# Altium project Carrier_Board_Template.PrjPcb (part 1 of 2)
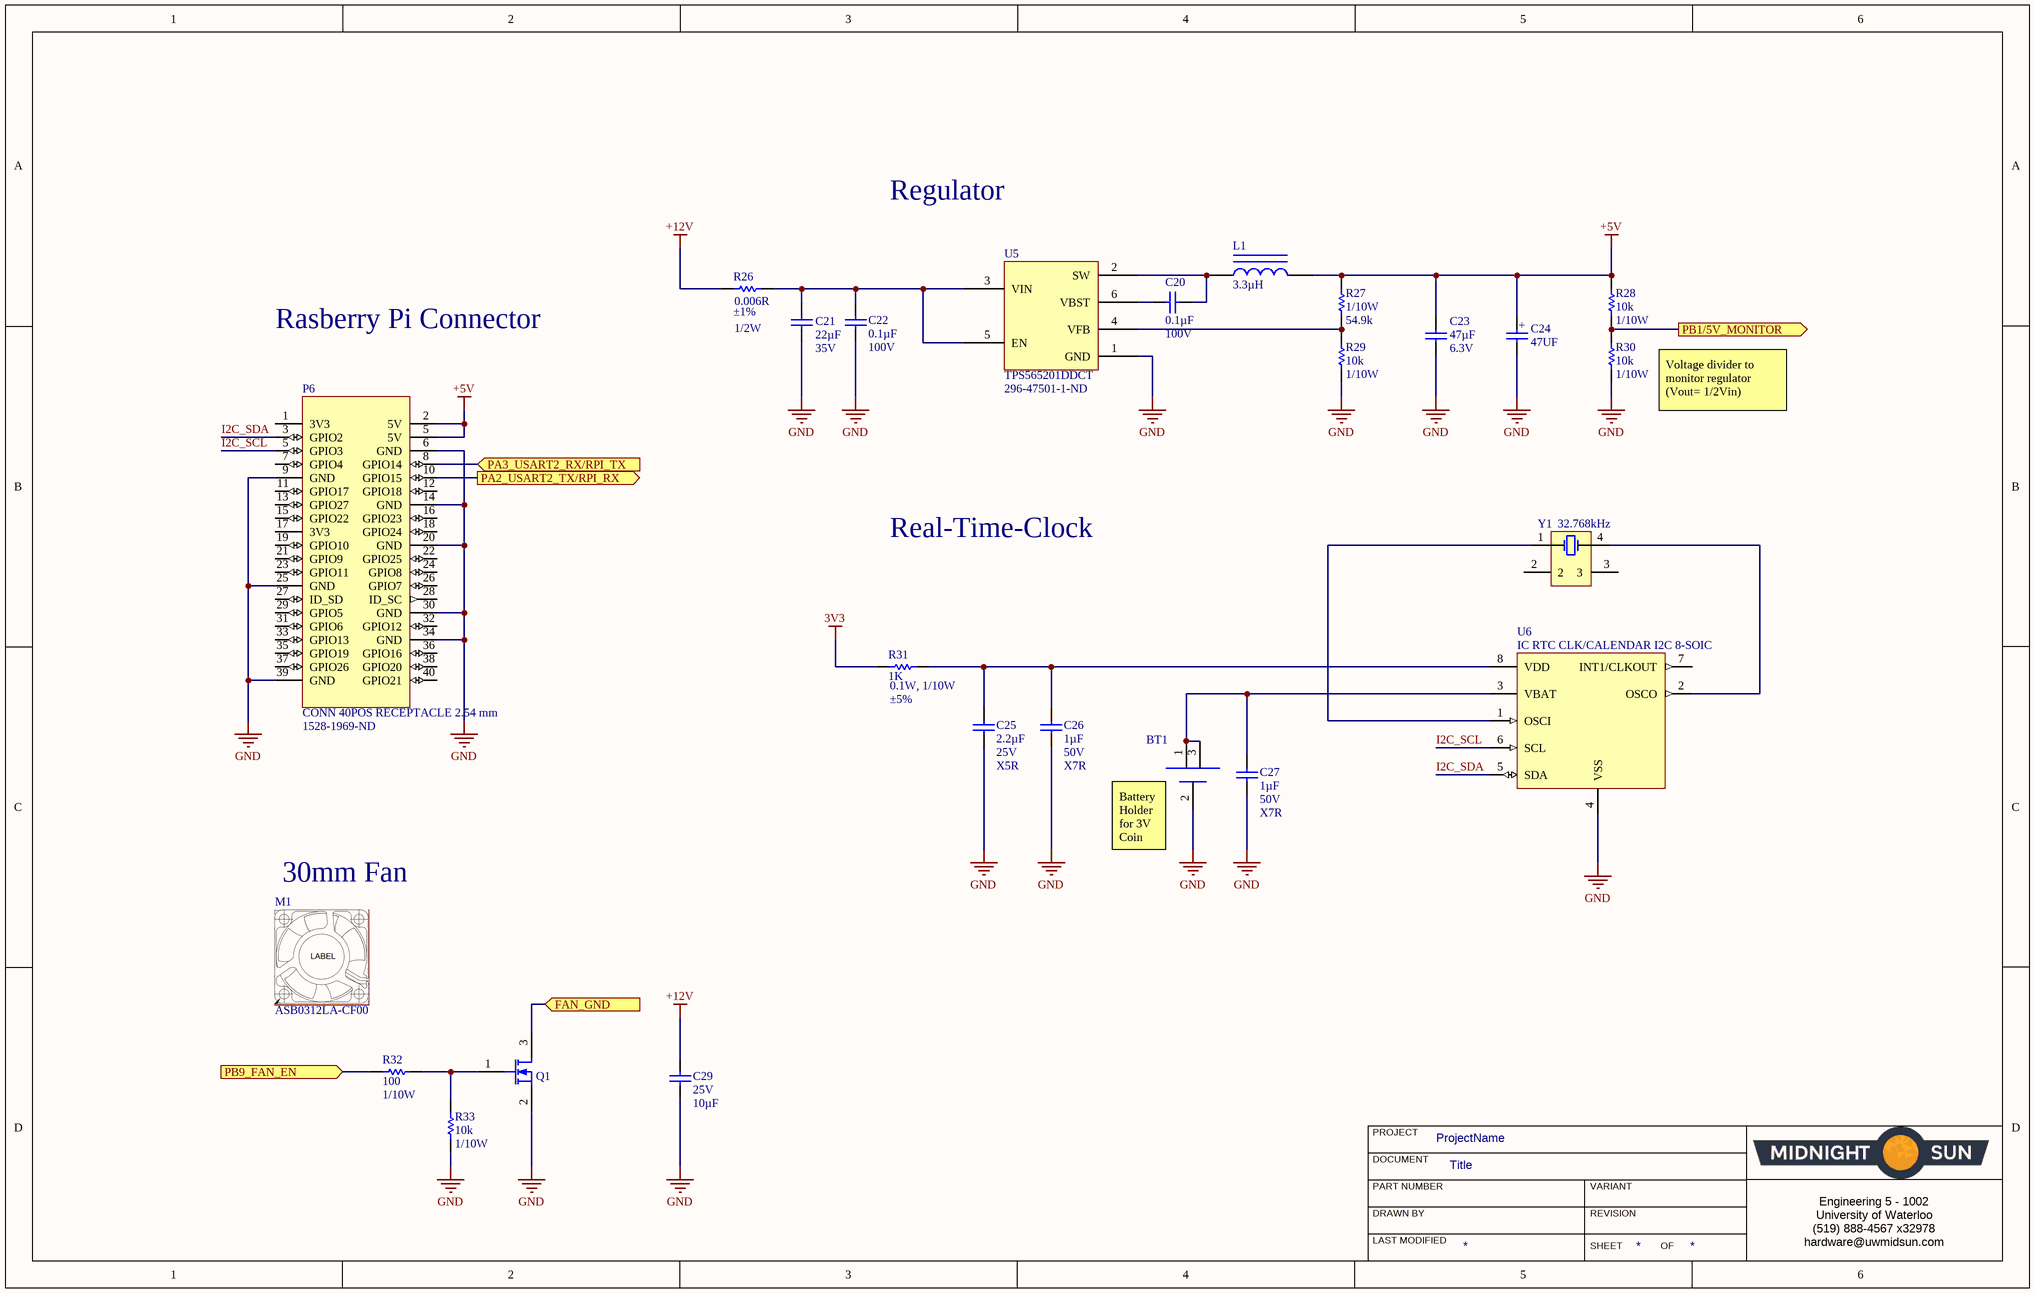
[diagram p0: rPi.SchDoc]

4 sheets, 86 parts. Net scope: flat (ports and power ports of the same name join across sheets).
Board file: Carrier_Board_Template.PcbDoc
Sheets:
  rPi.SchDoc
  buttons.SchDoc
  connectors.SchDoc
  leds.SchDoc

## Sheet rPi.SchDoc: Title
size B; Organization: Midnight Sun Solar Rayce Car Team; Address1: University of Waterloo; Address2: 200 University Ave W; Address3: Waterloo, ON, Canada; Address4: N2L 3E9; Website: www.uwmidsun.com; ProjectName: ProjectName

### Parts
BT1  HOLDER BATTERY COIN 12MM DIA  [HOLDER COIN CELL 1220 3V]  (value not drawn)
C20  Capacitance: 0.1µF  Voltage: 100V  [CAP, 0805]  (hidden comment: CAP CER 0.1UF 100V 10% X7R 0805)
C21  CAP CER 22UF 35V X5R 0805  [CAP, 0805]  (value not drawn)
C22  Capacitance: 0.1µF  Voltage: 100V  [CAP, 0805]  (hidden comment: CAP CER 0.1UF 100V 10% X7R 0805)
C23  CAP CER 47UF 6.3V X7R 1210  [1210]  (value not drawn)
C24  47UF  [CAP ALUM 6.3MM RADIAL SMD]
C25  Capacitance: 2.2µF  Voltage: 25V  Temperature Coefficient: X5R  [CAP, 0603]  (hidden comment: CAP CER 2.2UF 25V 10% X5R 0603)
C26  Capacitance: 1µF  Voltage: 50V  Temperature Coefficient: X7R  [CAP, 0603]  (hidden comment: CAP CER 1UF 50V 10% X7R 0603)
C27  Capacitance: 1µF  Voltage: 50V  Temperature Coefficient: X7R  [CAP, 0603]  (hidden comment: CAP CER 1UF 50V 10% X7R 0603)
C29  Voltage - Rated: 25V  Capacitance: 10µF  [CAP, 0805]  (hidden comment: CAP CER 10uF 25V 10% X5R 0805)
L1  Inductance: 3.3µH  [IND 3.3UH 5.2A 20 MOHM SMD VLP8040]  (hidden comment: IND 3.3uH 5.2A 20MOHM SMD)
M1  Manufacturer Part Number: ASB0312LA-CF00  [FAN AXIAL 30x10MM 12VDC]  (hidden comment: FAN AXIAL 30x10MM 12VDC)
P6  CONN 40POS RECEPTACLE 2.54 mm  Supplier Part Number 1: 1528-1969-ND  [CONN 40POS RECEPTACLE 2.54 MM]
Q1  MOSFET N-CH 30V 6.2A 0.9W SOT-23  [MOSFET N-CH 30V 6.2A 0.9W SOT-23]  (value not drawn)
R26  Tolerance: ±1%  Resistance (Ohms): 0.006R  Power (Watts): 1/2W  [RES 1206]  (hidden comment: RES 0.006 OHM 1% 1/2W 1206)
R27  Power (Watts): 1/10W  Resistance (Ohms): 54.9k  [RES, 0603]  (hidden comment: RES 54.9K OHM 1% 1/10W 0603)
R28  Resistance: 10k  Power: 1/10W  [RES, 0603]  (hidden comment: RES 10K OHM 1% 1/10W 0603)
R29  Resistance: 10k  Power: 1/10W  [RES, 0603]  (hidden comment: RES 10K OHM 1% 1/10W 0603)
R30  Resistance: 10k  Power: 1/10W  [RES, 0603]  (hidden comment: RES 10K OHM 1% 1/10W 0603)
R31  1K  Tolerance: ±5%  Power (Watts): 0.1W, 1/10W  [RES, 0603]
R32  Resistance: 100  Power: 1/10W  [RES, 0603]  (hidden comment: RES 100 OHM 1% 1/10W 0603)
R33  Resistance: 10k  Power: 1/10W  [RES, 0603]  (hidden comment: RES 10K OHM 1% 1/10W 0603)
U5  Manufacturer Part Number: TPS565201DDCT  Supplier Part Number 1: 296-47501-1-ND  [IC REG BUCK 4.5V TO 17V, 5A]  (hidden comment: IC REG BUCK 4.5V TO 17V, 5A, SYNCHRONOUS STE)
U6  IC RTC CLK/CALENDAR I2C 8-SOIC  [SOIC8]
Y1  Frequency: 32.768kHz  [4-SOJ]  (hidden comment: CRYSTAL 32.7680KHZ 12.5PF SMD)

### Ports
FAN_GND (in), PA2_USART2_TX/RPI_RX (out), PA3_USART2_RX/RPI_TX (in), PB1/5V_MONITOR (out), PB9_FAN_EN (in)

### Nets
3V3: R31.1
+5V: C23.1 C24.1 L1.2 P6.2(5V) P6.5(5V) R27.1 R28.1
+12V: C29.1 R26.1
GND: BT1.2(negative) C21.2 C22.2 C23.2 C24.2 C25.2 C26.2 C27.2 C29.2 P6.6(GND) P6.9(GND) P6.14(GND) P6.20(GND) P6.25(GND) P6.30(GND) P6.34(GND) P6.39(GND) Q1.2(S) R29.2 R30.2 R33.2 U5.1(GND) U6.4(VSS)
FAN_GND: Q1.3(D) ; port FAN_GND
I2C_SCL: P6.5(GPIO3) U6.6(SCL)
I2C_SDA: P6.3(GPIO2) U6.5(SDA)
PA2_RPI_USART2_TX: P6.10(GPIO15) ; port PA2_USART2_TX/RPI_RX
PA3_RPI_USART2_RX: P6.8(GPIO14) ; port PA3_USART2_RX/RPI_TX
PB1/5V_MONITOR: R28.2 R30.1 ; port PB1/5V_MONITOR
PB9_FAN_EN: R32.1 ; port PB9_FAN_EN
NetBT1_1: BT1.1(positive_1) BT1.3(positive_2) C27.1 U6.3(VBAT)
NetC20_1: C20.1 U5.6(VBST)
NetC20_2: C20.2 L1.1 U5.2(SW)
NetC21_1: C21.1 C22.1 R26.2 U5.3(VIN) U5.5(EN)
NetC25_1: C25.1 C26.1 R31.2 U6.8(VDD)
NetQ1_1: Q1.1(G) R32.2 R33.1
NetR27_2: R27.2 R29.1 U5.4(VFB)
NetU6_1: U6.1(OSCI) Y1.1
NetU6_2: U6.2(OSCO) Y1.4

Not connected (* = marked no-connect by the designer): P6 1(3V3) 7(GPIO4) 11(GPIO17) 12(GPIO18) 13(GPIO27) 15(GPIO22) 16(GPIO23) 17(3V3) 18(GPIO24) 19(GPIO10) 21(GPIO9) 22(GPIO25) 23(GPIO11) 24(GPIO8) 26(GPIO7) 27(ID_SD) 28(ID_SC) 29(GPIO5) 31(GPIO6) 32(GPIO12) 33(GPIO13) 35(GPIO19) 36(GPIO16) 37(GPIO26) 38(GPIO20) 40(GPIO21); U6 7(INT1/CLKOUT); Y1 2 3

### Notes on the sheet
- Regulator
- Rasberry Pi Connector
- Voltage divider to monitor regulator (Vout= 1/2Vin)
- Real-Time-Clock
- (near M1) 30mm Fan
- (near BT1) Battery Holder for 3V Coin Cell
- PROJECT
- DOCUMENT
- DRAWN BY
- LAST MODIFIED
- PART NUMBER
- REVISION
- SHEET
- VARIANT
- OF
- Engineering 5 - 1002
  University of Waterloo
  (519) 888-4567 x32978
  hardware@uwmidsun.com
- (in symbol CAP ALUM 47UF 20% 35V SMD) +
- (in symbol CAP CER 22UF 35V X5R 0805) 22µF
- (in symbol CAP CER 47UF 6.3V X7R 1210) 47µF

### Library data of the parts
BT1 = HOLDER BATTERY COIN 12MM DIA: Coin cell holder smd; Manufacturer: Keystone Electronics; Manufacturer Part Number: 3000; Body Material: Bronze; Number of Batteries: 1; Supplier 1: Digi-Key; Stock 1: 17093; Pricing 1: 1=0.58, 10=0.545, 50=0.4356, 100=0.4175, 250=0.38116, 500=0.363, 1000=0.30495, 2500=0.27225, 5000=0.26318 (USD); Mount: Surface Mount,PCB; Contact Material: Bronze,Nickel; Material: Bronze; Contact Plating: Nickel; Package Quantity: 100; Packaging: Bulk; Termination: SMD/SMT; Number of Cells: 1; Diameter: 12mm; Height: 3.17mm; REACH SVHC: No SVHC; Lead Free: Lead Free; ComponentLink1URL: https://datasheet.ciiva.com/3/3000-3953.pdf; ComponentLink1Description: https://datasheet.ciiva.com/3/3000-3953.pdf; ComponentLink2URL: https://datasheet.ciiva.com/11714/0900766b8002ef78-11714721.pdf; ComponentLink2Description: https://datasheet.ciiva.com/11714/0900766b8002ef78-11714721.pdf; ComponentLink3URL: https://datasheet.ciiva.com/20221/18-3570e-20221596.pdf; ComponentLink3Description: https://datasheet.ciiva.com/20221/18-3570e-20221596.pdf; ComponentLink4URL: https://datasheet.ciiva.com/1391/1718262-1391630.pdf; ComponentLink4Description: https://datasheet.ciiva.com/1391/1718262-1391630.pdf; Supplier Part Number 1: 36-3000-ND
C20 C22 = CAP CER 0.1UF 100V 10% X7R 0805: 0.1µF ±10% 100V Ceramic Capacitor X7R 0805 (2012 Metric); Manufacturer 1: Murata Electronics North America; Manufacturer Part Number 1: GCM21BR72A104KA37L; Supplier 1: Digi-Key; Supplier Part Number 1: 490-4789-1-ND; Packaging: Cut Tape (CT); Part Status: Active; Operating Temperature: -55°C ~ 125°C; Ratings: AEC-Q200; Mounting Type: Surface Mount, MLCC; Package / Case: 0805 (2012 Metric); Size / Dimension: 0.079" L x 0.049" W (2.00mm x 1.25mm); Height - Seated (Max): -; Thickness (Max): 0.055" (1.40mm); Lead Spacing: -; Lead Style: -; ComponentLink1URL: http://www.murata.com/~/media/webrenewal/support/library/catalog/products/capacitor/mlcc/c03e.ashx; ComponentLink1Description: http://www.murata.com/~/media/webrenewal/support/library/catalog/products/capacitor/mlcc/c03e.ashx; Tolerance: ±10%; Temperature Coefficient: X7R
C21 = CAP CER 22UF 35V X5R 0805: 22µF ±20% 35V Ceramic Capacitor X5R 0805 (2012 Metric); Manufacturer: TDK; Manufacturer Part Number: C2012X5R1V226M125AC; Supplier 1: Digi-Key; RoHS: Yes; Stock 1: 30; Pricing 1: 1 = 1.29000, 10 = 0.98100, 100 = 0.70190, 500 = 0.54338, 1000 = 0.46791 (USD); Mount: Surface Mount; Case/Package: 0805; Weight: 0.000194oz; Case Code (Metric): 2012; Case Code (Imperial): 0805; Dielectric Material: Ceramic; Min Operating Temperature: -55°C; Max Operating Temperature: 85°C; Package Quantity: 2000; Packaging: Tape and Reel; Capacitance: 22uF; Tolerance: 20%; Voltage Rating: 35V; Dielectric: X5R; Termination: SMD/SMT; Voltage Rating (DC): 35V; Length: 0.079inch; Height: 1.25mm; Width: 0.049inch; Thickness: 0.057inch; REACH SVHC: No SVHC; Lead Free: Lead Free; ComponentLink1URL: https://product.tdk.com/info/en/catalog/spec/mlccspec_commercial_general_midvoltage_en.pdf; ComponentLink1Description: https://product.tdk.com/info/en/catalog/spec/mlccspec_commercial_general_midvoltage_en.pdf; Supplier Part Number 1: 445-14428-1-ND
C23 = CAP CER 47UF 6.3V X7R 1210: 47µF ±10% 6.3V Ceramic Capacitor X7R 1210 (3225 Metric); Manufacturer: Murata; Manufacturer Part Number: GCJ32ER70J476KE01L; Supplier 1: Digi-Key; RoHS: Yes; Stock 1: 191399; Pricing 1: 1 = 1.53000, 10 = 1.21200, 100 = 0.90890, 500 = 0.68670 (USD); Mount: Surface Mount; Case/Package: 1210; Weight: 0.00388oz; Case Code (Metric): 3225; Case Code (Imperial): 1210; Min Operating Temperature: -55°C; Max Operating Temperature: 125°C; Capacitance: 47uF; Packaging: Tape and Reel; Voltage Rating: 6.3V; Tolerance: 10%; Dielectric: X7R; Termination: SMD/SMT; Voltage Rating (DC): 6.3V; Package Quantity: 1000; Features: Soft Termination; Length: 0.126inch; Height: 2.5mm; Width: 0.098inch; Thickness: 0.11inch; Ratings: AEC-Q200; Lead Free: Lead Free; Supplier Part Number 1: 490-10559-1-ND
C24 = CAP ALUM 47UF 20% 35V SMD: 47µF 35V Aluminum Electrolytic Capacitors Radial, Can - SMD 1000 Hrs @ 85°C; Manufacturer: Panasonic; Manufacturer Part Number: EEE-1VA470WP; Tolerance: 20%; Ripple Current: 70mA; Life (Hours): 1000Hour; Supplier 1: Digi-Key; Stock 1: 2820; Pricing 1: 1=0.38, 10=0.263, 100=0.1579, 500=0.11846 (USD); Mount: Surface Mount,PCB; Case/Package: Radial; Contact Plating: Tin; Min Operating Temperature: -40°C; Max Operating Temperature: 85°C; Capacitance: 47uF; Voltage Rating (DC): 35V; Voltage Rating: 35V; Packaging: Tape and Reel; Package Quantity: 1; Ripple Current (AC): 70mA; Termination: SMD/SMT; Diameter: 6.3mm; Length: 5.5mm; Height: 5.4mm; Height - Seated (Max): 0.213inch; Radiation Hardening: No; REACH SVHC: Unknown; Lead Free: Lead Free; ComponentLink1URL: https://datasheet.ciiva.com/2983/aba0000ce2-2983926.pdf; ComponentLink1Description: https://datasheet.ciiva.com/2983/aba0000ce2-2983926.pdf; ComponentLink2URL: https://datasheet.ciiva.com/2983/aba0000ce2-2983927.pdf; ComponentLink2Description: https://datasheet.ciiva.com/2983/aba0000ce2-2983927.pdf; ComponentLink3URL: https://datasheet.ciiva.com/14598/70255710-14598937.pdf; ComponentLink3Description: https://datasheet.ciiva.com/14598/70255710-14598937.pdf; ComponentLink4URL: https://datasheet.ciiva.com/15165/getdatasheetpartid-86239-15165868.pdf; ComponentLink4Description: https://datasheet.ciiva.com/15165/getdatasheetpartid-86239-15165868.pdf; ComponentLink5URL: https://datasheet.ciiva.com/16507/aba0000ce2-16507965.pdf; ComponentLink5Description: https://datasheet.ciiva.com/16507/aba0000ce2-16507965.pdf; ComponentLink6URL: https://datasheet.ciiva.com/30206/11aba0000ce2-30206253.pdf; ComponentLink6Description: https://datasheet.ciiva.com/30206/11aba0000ce2-30206253.pdf; Supplier Part Number 1: PCE3961CT-ND
C25 = CAP CER 2.2UF 25V 10% X5R 0603: 2.2µF ±10% 25V Ceramic Capacitor X5R 0603 (1608 Metric); Manufacturer 1: Murata Electronics North America; Manufacturer Part Number 1: GRM188R61E225KA12D; Supplier 1: Digi-Key; Supplier Part Number 1: 490-10731-1-ND; Packaging: Cut Tape (CT); Part Status: Active; Operating Temperature: -55°C ~ 85°C; Ratings: -; Mounting Type: Surface Mount, MLCC; Package / Case: 0603 (1608 Metric); Size / Dimension: 0.063" L x 0.031" W (1.60mm x 0.80mm); Height - Seated (Max): -; Thickness (Max): 0.035" (0.90mm); Lead Spacing: -; Lead Style: -; ComponentLink1URL: http://www.murata.com/~/media/webrenewal/support/library/catalog/products/capacitor/mlcc/c02e.ashx; ComponentLink1Description: http://www.murata.com/~/media/webrenewal/support/library/catalog/products/capacitor/mlcc/c02e.ashx; Tolerance: ±10%
C26 C27 = CAP CER 1UF 50V 10% X7R 0603: 1µF ±10% 50V Ceramic Capacitor X7R 0603 (1608 Metric); Manufacturer 1: Taiyo Yuden; Manufacturer Part Number 1: UMK107AB7105KA-T; Supplier 1: Digi-Key; Supplier Part Number 1: 587-3247-1-ND; Packaging: Cut Tape (CT); Part Status: Active; Operating Temperature: -55°C ~ 125°C; Ratings: -; Mounting Type: Surface Mount, MLCC; Package / Case: 0603 (1608 Metric); Size / Dimension: 0.063" L x 0.031" W (1.60mm x 0.80mm); Height - Seated (Max): -; Thickness (Max): 0.037" (0.95mm); Lead Spacing: -; Lead Style: -; ComponentLink1URL: http://www.yuden.co.jp/productdata/catalog/en/mlcc_all_e.pdf; ComponentLink1Description: http://www.yuden.co.jp/productdata/catalog/en/mlcc_all_e.pdf; Tolerance: ±10%
C29 = CAP CER 10uF 25V 10% X5R 0805: 10µF ±10% 25V Ceramic Capacitor X5R 0805 (2012 Metric); Manufacturer: Murata Electronics North America; Manufacturer Part Number: GRM21BR61E106KA73L; Supplier 1: Digi-Key; RoHS: RoHS Compliant; Category: Capacitors; Stock 1: 1695157; Packaging: Cut Tape (CT); Part Status: Active; Tolerance: ±10%; Temperature Coefficient: X5R; Operating Temperature: -55°C ~ 85°C; Features: -; Ratings: -; Applications: General Purpose; Mounting Type: Surface Mount, MLCC; Package / Case: 0805 (2012 Metric); Size / Dimension: 0.079" L x 0.049" W (2.00mm x 1.25mm); Height - Seated (Max): -; Thickness (Max): 0.053" (1.35mm); Lead Spacing: -; Lead Style: -; ComponentLink1URL: http://search.murata.co.jp/Ceramy/image/img/A01X/G101/ENG/GRM21BR61E106KA73-01.pdf; ComponentLink1Description: http://search.murata.co.jp/Ceramy/image/img/A01X/G101/ENG/GRM21BR61E106KA73-01.pdf; Supplier Part Number 1: 490-5523-1-ND; Pricing 1: 1=0.3, 10=0.214, 100=0.1008, 500=0.07068, 1000=0.05851 (CAD)
L1 = IND 3.3uH 5.2A 20MOHM SMD: 3.3µH Shielded Wirewound Inductor 5.2A 20 mOhm Max Nonstandard; Manufacturer: TDK Corporation; Manufacturer Part Number: VLS201612CX-3R3M; Material - Core: Ferrite; Tolerance: ±20%; Current Rating: 1.37A; Current - Saturation: 1.04A; DC Resistance (DCR): 170 mOhm Max; Frequency - Test: 1MHz; Inductance Tolerance: 30%; Test Frequency: 100kHz; RoHS: RoHS Compliant; Category: Inductors, Coils, Chokes; Packaging: Cut Tape (CT); Type: Wirewound; Shielding: Shielded; Q @ Freq: -; Frequency - Self Resonant: -; Operating Temperature: -40°C ~ 105°C; Mounting Type: Surface Mount; Package / Case: Nonstandard; Size / Dimension: 0.079" L x 0.063" W (2.00mm x 1.60mm); Height - Seated (Max): 0.047" (1.20mm); Supplier Device Package: 2016; ComponentLink1URL: http://product.tdk.com/en/catalog/datasheets/inductor_commercial_power_vls-cx_en.pdf; ComponentLink1Description: http://product.tdk.com/en/catalog/datasheets/inductor_commercial_power_vls-cx_en.pdf; Supplier 1: Digi-Key; Stock 1: 8114; Pricing 1: 1 = 0.60000, 10 = 0.52700, 100 = 0.37660, 500 = 0.31636 (USD); Mount: Surface Mount; Case/Package: Nonstandard; Core Material: Ferrite; Min Operating Temperature: -40°C; Max Operating Temperature: 105°C; Package Quantity: 1; Saturation Current: 5.2A; Max DC Current: 5.2A; Termination: SMD/SMT; Composition: Wirewound; RMS Current (Irms): 5.2A; Military Standard: Not; Length: 0.315inch; Height: 4mm; Width: 8mm; Depth: 8.7mm; REACH SVHC: No SVHC; Lead Free: Lead Free; ComponentLink2URL: http://www.mouser.com/ds/2/400/nductor_commercial_power_vlp8040_en-952627.pdf; ComponentLink2Description: http://www.mouser.com/ds/2/400/nductor_commercial_power_vlp8040_en-952627.pdf; Supplier Part Number 1: 445-6581-1-ND
M1 = FAN AXIAL 30x10MM 12VDC: FAN AXIAL 30X10MM 12VDC WIRE; Manufacturer: Delta Design; Current Rating: 50mA; Airflow: 3.2CFM; Noise: 21dBA; Max Power Dissipation: 600mW; RPM: 8000RPM; Bearing Type: Sleeve; Supplier 1: Digi-Key; Supplier Part Number 1: 603-1728-ND; RoHS: Yes; Stock 1: 2468; Case/Package: Axial; Weight: 0.016lb; Package Quantity: 1440; Termination: 3 Wire Leads; Width: 10mm; ComponentLink1URL: http://www.delta-fan.com/Download/Spec/ASB0312LA-CF00.pdf; ComponentLink1Description: http://www.delta-fan.com/Download/Spec/ASB0312LA-CF00.pdf
P6 = CONN 40POS RECEPTACLE 2.54 mm: GPIO HEADER FOR RASPBERRYPI A+/B; Manufacturer: Adafruit Industries; Manufacturer Part Number: 1992; Supplier 1: Digi-Key; Stock 1: 175; Pricing 1: 1=2.95 (USD); ComponentLink1Description: gpio header raspberry pi; ComponentLink1URL: https://www.digikey.ca/product-detail/en/adafruit-industries-llc/1992/1528-1969-ND/6827092
Q1 = MOSFET N-CH 30V 6.2A 0.9W SOT-23: N-Channel 30V 6.2A (Ta) 900mW (Ta) Surface Mount SOT-23; Manufacturer: Diodes; Manufacturer Part Number: DMN3023L-7; Rds On Max: 25mR; Input Capacitance: 873pF; Supplier 1: Digi-Key; Stock 1: 38246; Pricing 1: 1=0.47, 10=0.368, 100=0.2529, 500=0.1734, 1000=0.1301 (USD); Mount: Surface Mount; Case/Package: TO-236-3; Min Operating Temperature: -55°C; Max Operating Temperature: 150°C; Packaging: Tape and Reel; Drain to Source Voltage (Vdss): 30V; Continuous Drain Current (ID): 6.2A; Max Power Dissipation: 900mW; ComponentLink1URL: https://www.diodes.com/assets/Datasheets/DMN3023L.pdf; ComponentLink1Description: https://www.diodes.com/assets/Datasheets/DMN3023L.pdf; ComponentLink2URL: http://www.mouser.com/ds/2/115/DMN3023L-959533.pdf; ComponentLink2Description: http://www.mouser.com/ds/2/115/DMN3023L-959533.pdf; Supplier Part Number 1: DMN3023L-7DICT-ND
R26 = RES 0.006 OHM 1% 1/2W 1206: 0.006 Ohm ±1% 0.5W, 1/2W Chip Resistor 1206 (3216 Metric) Automotive AEC-Q200, Current Sense, Moisture Resistant Metal Element; Manufacturer: Panasonic Electronic Components; Manufacturer Part Number: ERJ-MP2KF6M0U; Temperature Coefficient: ±75ppm/°C; Supplier 1: Digi-Key; Supplier Part Number 1: P19333CT-ND; Packaging: Cut Tape (CT); Part Status: Active; Composition: Metal Element; Operating Temperature: -65°C ~ 170°C; Package / Case: 1206 (3216 Metric); Supplier Device Package: 1206; Size / Dimension: 0.125" L x 0.063" W (3.18mm x 1.60mm); Height - Seated (Max): 0.035" (0.89mm); Failure Rate: -; ComponentLink1URL: http://industrial.panasonic.com/cdbs/www-data/pdf/RDN0000/AOA0000C263.pdf; ComponentLink1Description: http://industrial.panasonic.com/cdbs/www-data/pdf/RDN0000/AOA0000C263.pdf; RoHS: RoHS Compliant; Category: Resistors; Features: Automotive AEC-Q200, Current Sense, Moisture Resistant
R27 = RES 54.9K OHM 1% 1/10W 0603: 54.9k Ohm ±1% 0.1W, 1/10W Chip Resistor 0603 (1608 Metric) Automotive AEC-Q200 Thick Film; Manufacturer: Panasonic Electronic Components; Manufacturer Part Number: ERJ-3EKF5492V; Temperature Coefficient: ±100ppm/°C; Supplier 1: Digi-Key; RoHS: RoHS Compliant; Category: Resistors; Stock 1: 74038; Pricing 1: 1=0.16, 10=0.031, 100=0.0127, 1000=0.00567, 2500=0.00492 (CAD); Packaging: Cut Tape (CT); Part Status: Active; Composition: Thick Film; Features: Automotive AEC-Q200; Operating Temperature: -55°C ~ 155°C; Package / Case: 0603 (1608 Metric); Supplier Device Package: 0603; Size / Dimension: 0.063" L x 0.031" W (1.60mm x 0.80mm); Height - Seated (Max): 0.022" (0.55mm); Failure Rate: -; ComponentLink1URL: https://industrial.panasonic.com/cdbs/www-data/pdf/RDA0000/AOA0000C298.pdf; ComponentLink1Description: https://industrial.panasonic.com/cdbs/www-data/pdf/RDA0000/AOA0000C298.pdf; Supplier Part Number 1: P54.9KHCT-ND; Tolerance: ±1%
R28-R30 R33 = RES 10K OHM 1% 1/10W 0603: RES SMD 10K OHM 1% 1/10W 0603; Manufacturer 1: Yageo; Manufacturer Part Number 1: RC0603FR-0710KL; Temperature Coefficient: ±100ppm/°C; Supplier 1: Digi-Key; Supplier Part Number 1: 311-10.0KHRCT-ND; Packaging: Cut Tape (CT); Part Status: Active; Composition: Thick Film; Operating Temperature: -55°C ~ 155°C; Package / Case: 0603 (1608 Metric); Supplier Device Package: 0603; Size / Dimension: 0.063" L x 0.031" W (1.60mm x 0.80mm); Height - Seated (Max): 0.022" (0.55mm); Failure Rate: -; ComponentLink1URL: http://www.yageo.com/documents/recent/PYu-RC_Group_51_RoHS_L_7.pdf; ComponentLink1Description: http://www.yageo.com/documents/recent/PYu-RC_Group_51_RoHS_L_7.pdf; Tolerance: ±1%
R31 = RES 1K OHM 5% 1/10W 0603: 1k Ohm ±5% 0.1W, 1/10W Chip Resistor 0603 (1608 Metric); Manufacturer: Yageo; Manufacturer Part Number: RC0603JR-071KL; Temperature Coefficient: ±100ppm/°C; Supplier 1: Digi-Key; Supplier Part Number 1: 311-1.0KGRCT-ND; RoHS: RoHS Compliant; Category: Resistors; Stock 1: 4415240; Pricing 1: 1=0.15, 10=0.017, 100=0.0071, 1000=0.0032, 2500=0.00278 (CAD); Packaging: Cut Tape (CT); Part Status: Active; Resistance (Ohms): 1k; Composition: Thick Film; Features: Moisture Resistant; Operating Temperature: -55°C ~ 155°C; Package / Case: 0603 (1608 Metric); Supplier Device Package: 0603; Size / Dimension: 0.063" L x 0.031" W (1.60mm x 0.80mm); Height - Seated (Max): 0.022" (0.55mm); Failure Rate: -; ComponentLink1URL: http://www.yageo.com/documents/recent/PYu-RC_Group_51_RoHS_L_7.pdf; ComponentLink1Description: http://www.yageo.com/documents/recent/PYu-RC_Group_51_RoHS_L_7.pdf
R32 = RES 100 OHM 1% 1/10W 0603: 100 Ohm ±1% 0.1W, 1/10W Chip Resistor 0603 (1608 Metric) Moisture Resistant Thick Film; Manufacturer 1: Yageo; Manufacturer Part Number 1: RC0603FR-07100RL; Temperature Coefficient: ±100ppm/°C; Supplier 1: Digi-Key; Supplier Part Number 1: 311-100HRCT-ND; Packaging: Cut Tape (CT); Part Status: Active; Composition: Thick Film; Operating Temperature: -55°C ~ 155°C; Package / Case: 0603 (1608 Metric); Supplier Device Package: 0603; Size / Dimension: 0.063" L x 0.031" W (1.60mm x 0.80mm); Height - Seated (Max): 0.022" (0.55mm); Failure Rate: -; ComponentLink1URL: http://www.yageo.com/documents/recent/PYu-RC_Group_51_RoHS_L_7.pdf; ComponentLink1Description: http://www.yageo.com/documents/recent/PYu-RC_Group_51_RoHS_L_7.pdf; Tolerance: ±1%
U5 = IC REG BUCK 4.5V TO 17V, 5A, SYNCHRONOUS STE: Buck Switching Regulator IC Positive Adjustable 0.6V 1 Output 5A SOT-23-6 Thin, TSOT-23-6; Manufacturer: Texas Instruments; Supplier 1: Digi-Key; Stock 1: 2226; Pricing 1: 1 = 2.46000, 10 = 2.21100, 100 = 1.77710 (USD); Min Operating Temperature: -40°C; Max Operating Temperature: 125°C
U6 = IC RTC CLK/CALENDAR I2C 8-SOIC: Real Time Clock (RTC) IC Clock/Calendar I²C, 2-Wire Serial 8-SOIC (0.154", 3.90mm Width); Manufacturer: NXP Semiconductors; Manufacturer Part Number: PCF8523T/1,118; Min Supply Voltage: 1.2V; Max Supply Voltage: 5.5V; Time Format: HH:MM:SS; Supplier 1: Digi-Key; Stock 1: 18252; Pricing 1: 1=1.3, 10=1.16, 100=0.9045, 500=0.74718, 1000=0.58988 (USD); Mount: Surface Mount; Case/Package: SO; Number of Pins: 8; Contact Plating: Gold; Min Operating Temperature: -40°C; Max Operating Temperature: 85°C; Packaging: Tape and Reel; Interface: I2C; Package Quantity: 2500; Logic Function: Clock; Radiation Hardening: No; REACH SVHC: No SVHC; Lead Free: Lead Free; ComponentLink1URL: https://datasheet.ciiva.com/15152/getdatasheetpartid-445247-15152839.pdf; ComponentLink1Description: https://datasheet.ciiva.com/15152/getdatasheetpartid-445247-15152839.pdf; ComponentLink2URL: https://datasheet.ciiva.com/1238/pcf8523-1238780.pdf; ComponentLink2Description: https://datasheet.ciiva.com/1238/pcf8523-1238780.pdf; ComponentLink3URL: https://datasheet.ciiva.com/1238/pcf8523-1238781.pdf; ComponentLink3Description: https://datasheet.ciiva.com/1238/pcf8523-1238781.pdf; ComponentLink4URL: https://datasheet.ciiva.com/16286/pcf8523-16286477.pdf; ComponentLink4Description: https://datasheet.ciiva.com/16286/pcf8523-16286477.pdf; ComponentLink5URL: https://datasheet.ciiva.com/1238/pcf8523-1238782.pdf; ComponentLink5Description: https://datasheet.ciiva.com/1238/pcf8523-1238782.pdf; Supplier Part Number 1: 568-5306-1-ND
Y1 = CRYSTAL 32.7680KHZ 12.5PF SMD: 32.768kHz ±20ppm Crystal 12.5pF 50 kOhms 4-SOJ, 5.50mm pitch; Manufacturer: ECS International; Manufacturer Part Number: ECS-.327-12.5-17X-TR; ESR (Equivalent Series Resistance): 50kR; Supplier 1: Digi-Key; Stock 1: 67622; Pricing 1: 1=0.56, 10=0.468, 50=0.4208, 100=0.374, 500=0.3553, 1000=0.2992 (USD); Mount: Surface Mount; Min Operating Temperature: -40°C; Max Operating Temperature: 85°C; Package Quantity: 1; Frequency Tolerance: 20ppm; Load Capacitance: 12.5pF; Packaging: Tape and Reel; Tolerance: 20ppm; Termination: SMD/SMT; Length: 0.315inch; Height: 0.098inch; Width: 0.15inch; Lead Free: Lead Free; ComponentLink1URL: https://datasheet.ciiva.com/852/ecx-306x-852775.pdf; ComponentLink1Description: https://datasheet.ciiva.com/852/ecx-306x-852775.pdf; ComponentLink2URL: https://datasheet.ciiva.com/852/ecx-306x-852776.pdf; ComponentLink2Description: https://datasheet.ciiva.com/852/ecx-306x-852776.pdf; ComponentLink3URL: https://datasheet.ciiva.com/852/ecx-306x-852777.pdf; ComponentLink3Description: https://datasheet.ciiva.com/852/ecx-306x-852777.pdf; Supplier Part Number 1: XC1195CT-ND

## Sheet buttons.SchDoc: Title
size B; Organization: Midnight Sun Solar Rayce Car Team; Address1: University of Waterloo; Address2: 200 University Ave W; Address3: Waterloo, ON, Canada; Address4: N2L 3E9; Website: www.uwmidsun.com; ProjectName: ProjectName
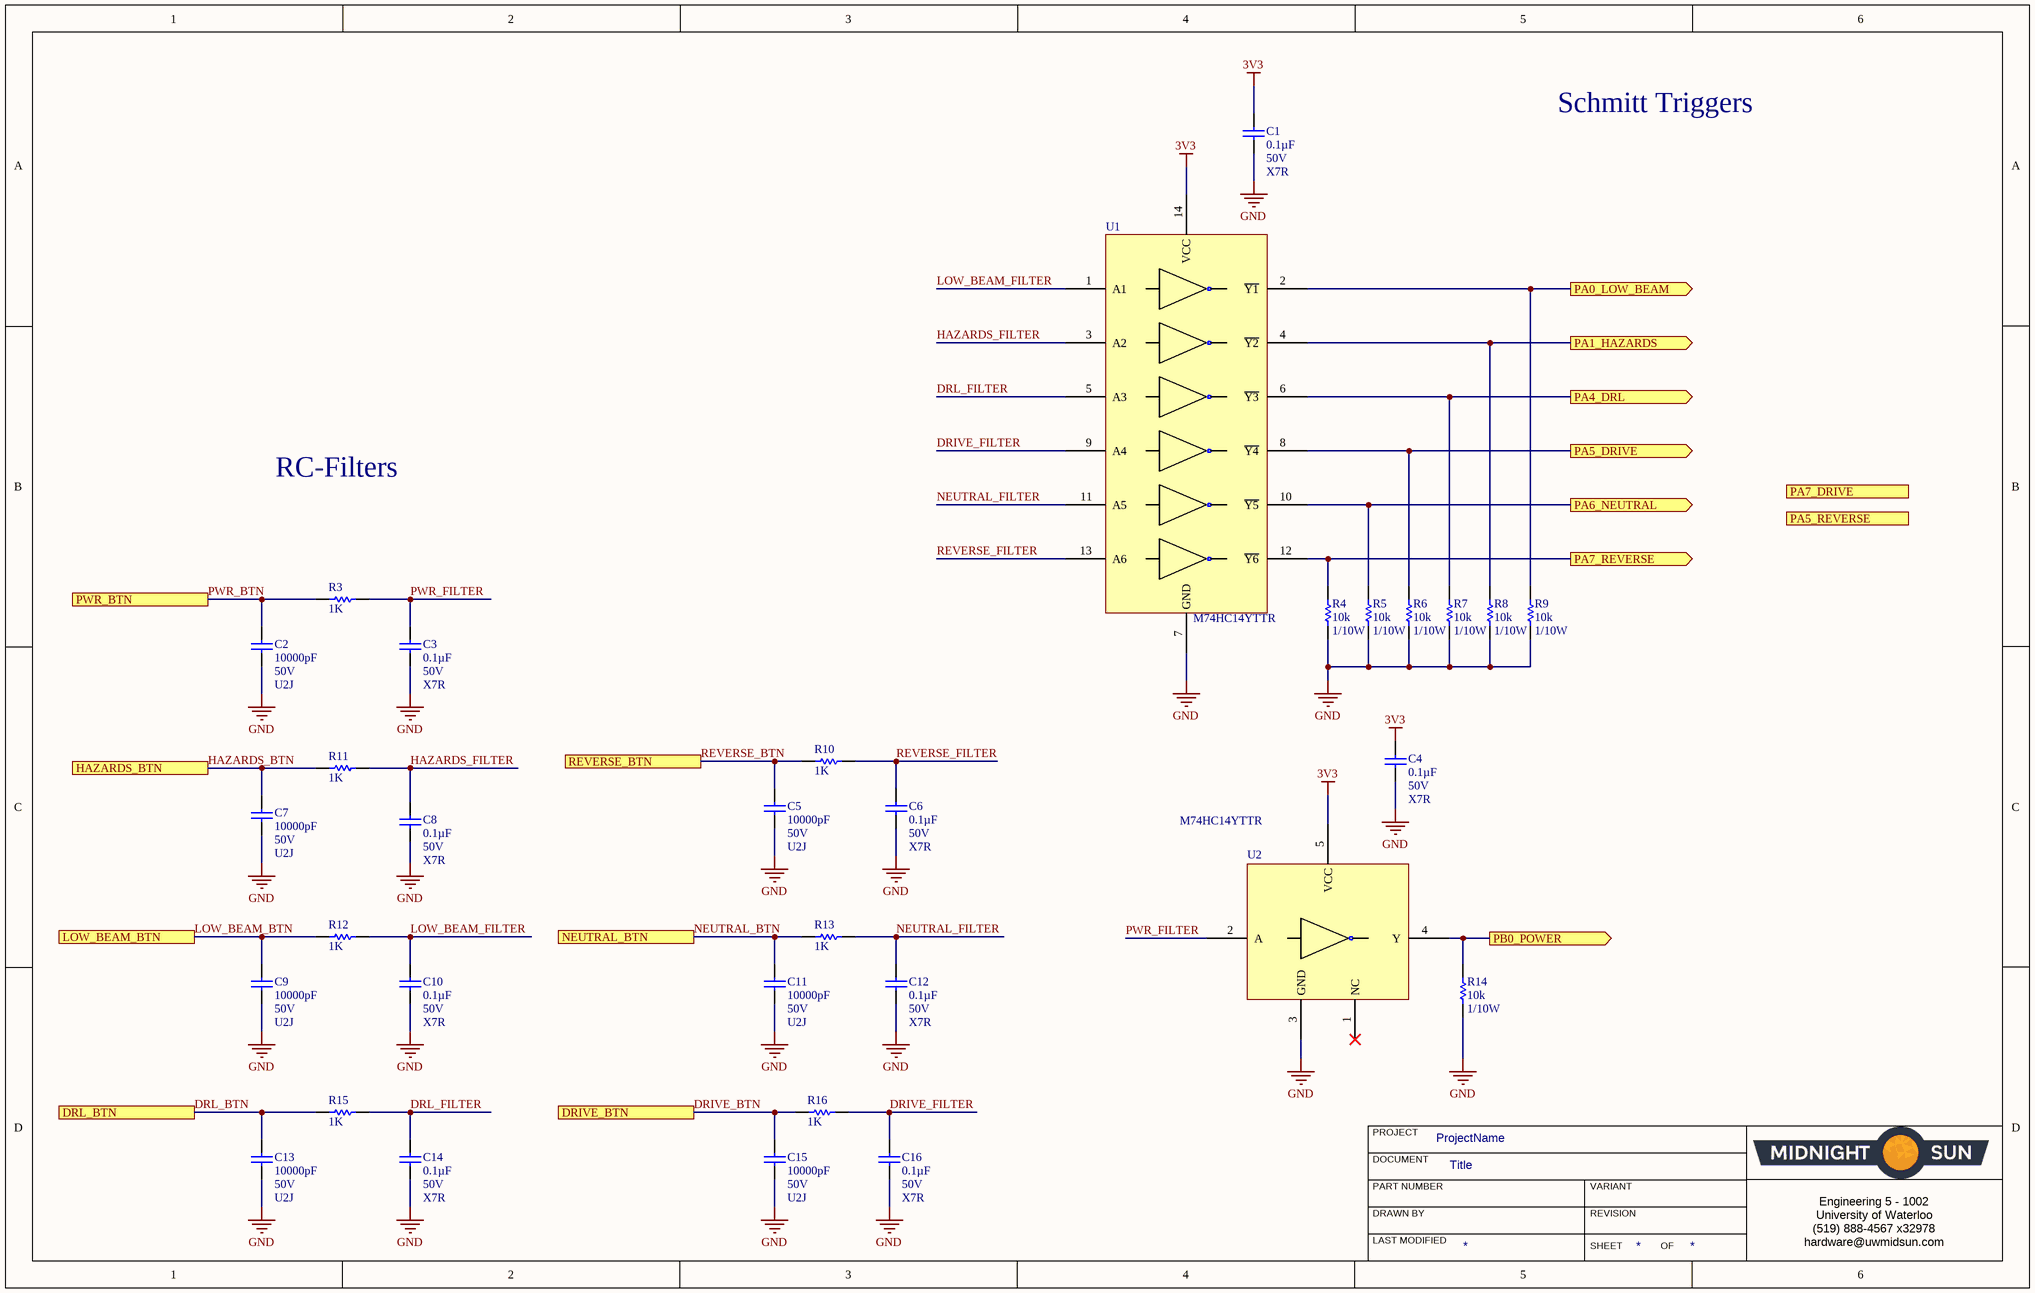
[diagram p1: buttons.SchDoc]

### Parts
C1  Capacitance: 0.1µF  Voltage: 50V  Temperature Coefficient: X7R  [CAP, 0603]  (hidden comment: CAP CER 0.1UF 50V 10% X7R 0603)
C2  Capacitance: 10000pF  Voltage: 50V  Temperature Coefficient: U2J  [CAP, 0603]  (hidden comment: CAP CER 10nF 50V 5% X7R 0603)
C3  Capacitance: 0.1µF  Voltage: 50V  Temperature Coefficient: X7R  [CAP, 0603]  (hidden comment: CAP CER 0.1UF 50V 10% X7R 0603)
C4  Capacitance: 0.1µF  Voltage: 50V  Temperature Coefficient: X7R  [CAP, 0603]  (hidden comment: CAP CER 0.1UF 50V 10% X7R 0603)
C5  Capacitance: 10000pF  Voltage: 50V  Temperature Coefficient: U2J  [CAP, 0603]  (hidden comment: CAP CER 10nF 50V 5% X7R 0603)
C6  Capacitance: 0.1µF  Voltage: 50V  Temperature Coefficient: X7R  [CAP, 0603]  (hidden comment: CAP CER 0.1UF 50V 10% X7R 0603)
C7  Capacitance: 10000pF  Voltage: 50V  Temperature Coefficient: U2J  [CAP, 0603]  (hidden comment: CAP CER 10nF 50V 5% X7R 0603)
C8  Capacitance: 0.1µF  Voltage: 50V  Temperature Coefficient: X7R  [CAP, 0603]  (hidden comment: CAP CER 0.1UF 50V 10% X7R 0603)
C9  Capacitance: 10000pF  Voltage: 50V  Temperature Coefficient: U2J  [CAP, 0603]  (hidden comment: CAP CER 10nF 50V 5% X7R 0603)
C10  Capacitance: 0.1µF  Voltage: 50V  Temperature Coefficient: X7R  [CAP, 0603]  (hidden comment: CAP CER 0.1UF 50V 10% X7R 0603)
C11  Capacitance: 10000pF  Voltage: 50V  Temperature Coefficient: U2J  [CAP, 0603]  (hidden comment: CAP CER 10nF 50V 5% X7R 0603)
C12  Capacitance: 0.1µF  Voltage: 50V  Temperature Coefficient: X7R  [CAP, 0603]  (hidden comment: CAP CER 0.1UF 50V 10% X7R 0603)
C13  Capacitance: 10000pF  Voltage: 50V  Temperature Coefficient: U2J  [CAP, 0603]  (hidden comment: CAP CER 10nF 50V 5% X7R 0603)
C14  Capacitance: 0.1µF  Voltage: 50V  Temperature Coefficient: X7R  [CAP, 0603]  (hidden comment: CAP CER 0.1UF 50V 10% X7R 0603)
C15  Capacitance: 10000pF  Voltage: 50V  Temperature Coefficient: U2J  [CAP, 0603]  (hidden comment: CAP CER 10nF 50V 5% X7R 0603)
C16  Capacitance: 0.1µF  Voltage: 50V  Temperature Coefficient: X7R  [CAP, 0603]  (hidden comment: CAP CER 0.1UF 50V 10% X7R 0603)
R3  1K  [RES, 0603]
R4  Resistance: 10k  Power: 1/10W  [RES, 0603]  (hidden comment: RES 10K OHM 1% 1/10W 0603)
R5  Resistance: 10k  Power: 1/10W  [RES, 0603]  (hidden comment: RES 10K OHM 1% 1/10W 0603)
R6  Resistance: 10k  Power: 1/10W  [RES, 0603]  (hidden comment: RES 10K OHM 1% 1/10W 0603)
R7  Resistance: 10k  Power: 1/10W  [RES, 0603]  (hidden comment: RES 10K OHM 1% 1/10W 0603)
R8  Resistance: 10k  Power: 1/10W  [RES, 0603]  (hidden comment: RES 10K OHM 1% 1/10W 0603)
R9  Resistance: 10k  Power: 1/10W  [RES, 0603]  (hidden comment: RES 10K OHM 1% 1/10W 0603)
R10  1K  [RES, 0603]
R11  1K  [RES, 0603]
R12  1K  [RES, 0603]
R13  1K  [RES, 0603]
R14  Resistance: 10k  Power: 1/10W  [RES, 0603]  (hidden comment: RES 10K OHM 1% 1/10W 0603)
R15  1K  [RES, 0603]
R16  1K  [RES, 0603]
U1  Manufacturer Part Number: M74HC14YTTR  [IC INVERTER SCHMITT 6CH 14TSSOP]  (hidden comment: IC INVERTER SCHMITT 6CH 14TSSOP)
U2  Manufacturer Part Number: M74HC14YTTR  [IC INVERTER SCHMITT 1CH SC70-5]  (hidden comment: IC INVERTER SCHMITT 1CH SC70-5)

### Ports
DRIVE_BTN, DRL_BTN, HAZARDS_BTN, LOW_BEAM_BTN, NEUTRAL_BTN, PA0_LOW_BEAM (out), PA1_HAZARDS (out), PA4_DRL (out), PA5_DRIVE (out), PA5_REVERSE (in), PA6_NEUTRAL (out), PA7_DRIVE (in), PA7_REVERSE (out), PB0_POWER (out), PWR_BTN, REVERSE_BTN

### Nets
3V3: C1.1 C4.1 U1.14(VCC) U2.5(VCC)
GND: C1.2 C2.2 C3.2 C4.2 C5.2 C6.2 C7.2 C8.2 C9.2 C10.2 C11.2 C12.2 C13.2 C14.2 C15.2 C16.2 R4.2 R5.2 R6.2 R7.2 R8.2 R9.2 R14.2 U1.7(GND) U2.3(GND)
DRIVE_BTN: C15.1 R16.1 ; port DRIVE_BTN
DRIVE_FILTER: C16.1 R16.2 U1.9(A4)
DRL_BTN: C13.1 R15.1 ; port DRL_BTN
DRL_FILTER: C14.1 R15.2 U1.5(A3)
HAZARDS_BTN: C7.1 R11.1 ; port HAZARDS_BTN
HAZARDS_FILTER: C8.1 R11.2 U1.3(A2)
LOW_BEAM_BTN: C9.1 R12.1 ; port LOW_BEAM_BTN
LOW_BEAM_FILTER: C10.1 R12.2 U1.1(A1)
NEUTRAL_BTN: C11.1 R13.1 ; port NEUTRAL_BTN
NEUTRAL_FILTER: C12.1 R13.2 U1.11(A5)
PA0_LOW_BEAM: R9.1 U1.2(~{Y1}) ; port PA0_LOW_BEAM
PA1_HAZARDS: R8.1 U1.4(~{Y2}) ; port PA1_HAZARDS
PA4_DRL: R7.1 U1.6(~{Y3}) ; port PA4_DRL
PA5_DRIVE: R6.1 U1.8(~{Y4}) ; port PA5_DRIVE
PA6_NEUTRAL: R5.1 U1.10(~{Y5}) ; port PA6_NEUTRAL
PA7_REVERSE: R4.1 U1.12(~{Y6}) ; port PA7_REVERSE
PB0_POWER: R14.1 U2.4(Y) ; port PB0_POWER
PWR_BTN: C2.1 R3.1 ; port PWR_BTN
PWR_FILTER: C3.1 R3.2 U2.2(A)
REVERSE_BTN: C5.1 R10.1 ; port REVERSE_BTN
REVERSE_FILTER: C6.1 R10.2 U1.13(A6)

Not connected (* = marked no-connect by the designer): U2 1(NC)*

### Notes on the sheet
- Schmitt Triggers
- RC-Filters
- PROJECT
- DOCUMENT
- DRAWN BY
- LAST MODIFIED
- PART NUMBER
- REVISION
- SHEET
- VARIANT
- OF
- Engineering 5 - 1002
  University of Waterloo
  (519) 888-4567 x32978
  hardware@uwmidsun.com

### Library data of the parts
C1 C3 C4 C6 C8 C10 C12 C14 C16 = CAP CER 0.1UF 50V 10% X7R 0603: 0.10µF ±10% 50V Ceramic Capacitor X7R 0603 (1608 Metric); Manufacturer 1: AVX Corporation; Manufacturer Part Number 1: 06035C104KAT2A; Supplier 1: Digi-Key; Supplier Part Number 1: 478-5052-1-ND; Packaging: Cut Tape (CT); Part Status: Active; Operating Temperature: -55°C ~ 125°C; Ratings: -; Mounting Type: Surface Mount, MLCC; Package / Case: 0603 (1608 Metric); Size / Dimension: 0.063" L x 0.032" W (1.60mm x 0.81mm); Height - Seated (Max): -; Thickness (Max): 0.035" (0.90mm); Lead Spacing: -; Lead Style: -; ComponentLink1URL: http://datasheets.avx.com/X7RDielectric.pdf; ComponentLink1Description: http://datasheets.avx.com/X7RDielectric.pdf; Tolerance: ±10%
C2 C5 C7 C9 C11 C13 C15 = CAP CER 10nF 50V 5% X7R 0603: 10000pF ±5% 50V Ceramic Capacitor U2J 0603 (1608 Metric); Manufacturer 1: KEMET; Manufacturer Part Number 1: C0603C103J5JAC7867; Supplier 1: Digi-Key; Supplier Part Number 1: 399-13384-1-ND; Packaging: Cut Tape (CT); Part Status: Active; Operating Temperature: -55°C ~ 125°C; Ratings: -; Failure Rate: -; Mounting Type: Surface Mount, MLCC; Package / Case: 0603 (1608 Metric); Size / Dimension: 0.063" L x 0.032" W (1.60mm x 0.80mm); Height - Seated (Max): -; Thickness (Max): 0.034" (0.87mm); Lead Spacing: -; Lead Style: -; ComponentLink1URL: http://www.kemet.com/docfinder?Partnumber=C0603C103J5JAC7867; ComponentLink1Description: http://www.kemet.com/docfinder?Partnumber=C0603C103J5JAC7867; Tolerance: ±5%
R3 R10-R13 R15 R16 = RES 1K OHM 5% 1/10W 0603: as R31 on sheet rPi; Supplier 1: Digi-Key; Supplier Part Number 1: 311-1.0KGRCT-ND; RoHS: RoHS Compliant; Category: Resistors; Stock 1: 4415240; Pricing 1: 1=0.15, 10=0.017, 100=0.0071, 1000=0.0032, 2500=0.00278 (CAD); Packaging: Cut Tape (CT); Part Status: Active; Resistance (Ohms): 1k; Tolerance: ±5%; Power (Watts): 0.1W, 1/10W; Composition: Thick Film; Features: Moisture Resistant; Operating Temperature: -55°C ~ 155°C; Package / Case: 0603 (1608 Metric); Supplier Device Package: 0603; Size / Dimension: 0.063" L x 0.031" W (1.60mm x 0.80mm); Height - Seated (Max): 0.022" (0.55mm); Failure Rate: -; ComponentLink1URL: http://www.yageo.com/documents/recent/PYu-RC_Group_51_RoHS_L_7.pdf; ComponentLink1Description: http://www.yageo.com/documents/recent/PYu-RC_Group_51_RoHS_L_7.pdf
R4-R9 R14 = RES 10K OHM 1% 1/10W 0603: as R28 on sheet rPi; Supplier 1: Digi-Key; Supplier Part Number 1: 311-10.0KHRCT-ND; Packaging: Cut Tape (CT); Part Status: Active; Composition: Thick Film; Operating Temperature: -55°C ~ 155°C; Package / Case: 0603 (1608 Metric); Supplier Device Package: 0603; Size / Dimension: 0.063" L x 0.031" W (1.60mm x 0.80mm); Height - Seated (Max): 0.022" (0.55mm); Failure Rate: -; ComponentLink1URL: http://www.yageo.com/documents/recent/PYu-RC_Group_51_RoHS_L_7.pdf; ComponentLink1Description: http://www.yageo.com/documents/recent/PYu-RC_Group_51_RoHS_L_7.pdf; Tolerance: ±1%
U1 = IC INVERTER SCHMITT 6CH 14TSSOP: Inverter IC 6 Channel Schmitt Trigger 14-TSSOP; Manufacturer: STMicroelectronics; Number of Inputs: 6; Propagation Delay: 21ns; Max Supply Voltage: 6V; Min Supply Voltage: 2V; Quiescent Current: 1uA; High Level Output Current: 5.2mA; Turn-On Delay Time: 25ns; ComponentLink1Description: Digikey; ComponentLink1URL: https://www.digikey.ca/product-detail/en/stmicroelectronics/M74HC14YTTR/497-14387-1-ND/4725844; Supplier 1: Digi-Key; RoHS: Yes; Stock 1: 20035; Pricing 1: 1 = 0.44000, 10 = 0.37500, 100 = 0.27970, 500 = 0.21980, 1000 = 0.16985 (USD); Mount: Surface Mount; Case/Package: TSSOP; Number of Pins: 14; Weight: 0.004949oz; Min Operating Temperature: -40°C; Max Operating Temperature: 125°C; Packaging: Tape and Reel; Package Quantity: 2500; Logic Function: Inverter; Number of Circuits: 6; Low Level Output Current: 5.2mA; Lead Free: Lead Free; ComponentLink2URL: http://www.st.com/content/ccc/resource/technical/document/datasheet/19/a3/52/42/dd/ab/4b/46/CD00000263.pdf/files/CD00000263.pdf/jcr:content/translations/en.CD00000263.pdf; ComponentLink2Description: http://www.st.com/content/ccc/resource/technical/document/datasheet/19/a3/52/42/dd/ab/4b/46/CD00000263.pdf/files/CD00000263.pdf/jcr:content/translations/en.CD00000263.pdf; ComponentLink3URL: http://www.st.com/st-web-ui/static/active/en/resource/technical/document/datasheet/CD00000263.pdf; ComponentLink3Description: http://www.st.com/st-web-ui/static/active/en/resource/technical/document/datasheet/CD00000263.pdf; Supplier Part Number 1: 497-14387-1-ND
U2 = IC INVERTER SCHMITT 1CH SC70-5: Inverter IC 1 Channel Schmitt Trigger SC-70-5; Manufacturer: STMicroelectronics; Number of Inputs: 6; Propagation Delay: 21ns; Max Supply Voltage: 6V; Min Supply Voltage: 2V; Quiescent Current: 1uA; High Level Output Current: 5.2mA; Turn-On Delay Time: 25ns; Number of Bits: 1; RoHS: Yes; Mount: Surface Mount; Case/Package: TSSOP; Number of Pins: 14; Weight: 0.004949oz; Min Operating Temperature: -40°C; Max Operating Temperature: 125°C; Packaging: Tape and Reel; Package Quantity: 2500; Logic Function: Inverter; Number of Circuits: 6; Low Level Output Current: 5.2mA; Lead Free: Lead Free; Supplier 1: Digi-Key; Stock 1: 11031; Pricing 1: 1 = 0.36000, 10 = 0.29000, 100 = 0.19780, 500 = 0.14832, 1000 = 0.11124 (USD); Supplier Part Number 1: 296-47215-1-ND

## Sheet connectors.SchDoc: Title
size B; Organization: Midnight Sun Solar Rayce Car Team; Address1: University of Waterloo; Address2: 200 University Ave W; Address3: Waterloo, ON, Canada; Address4: N2L 3E9; Website: www.uwmidsun.com; ProjectName: ProjectName
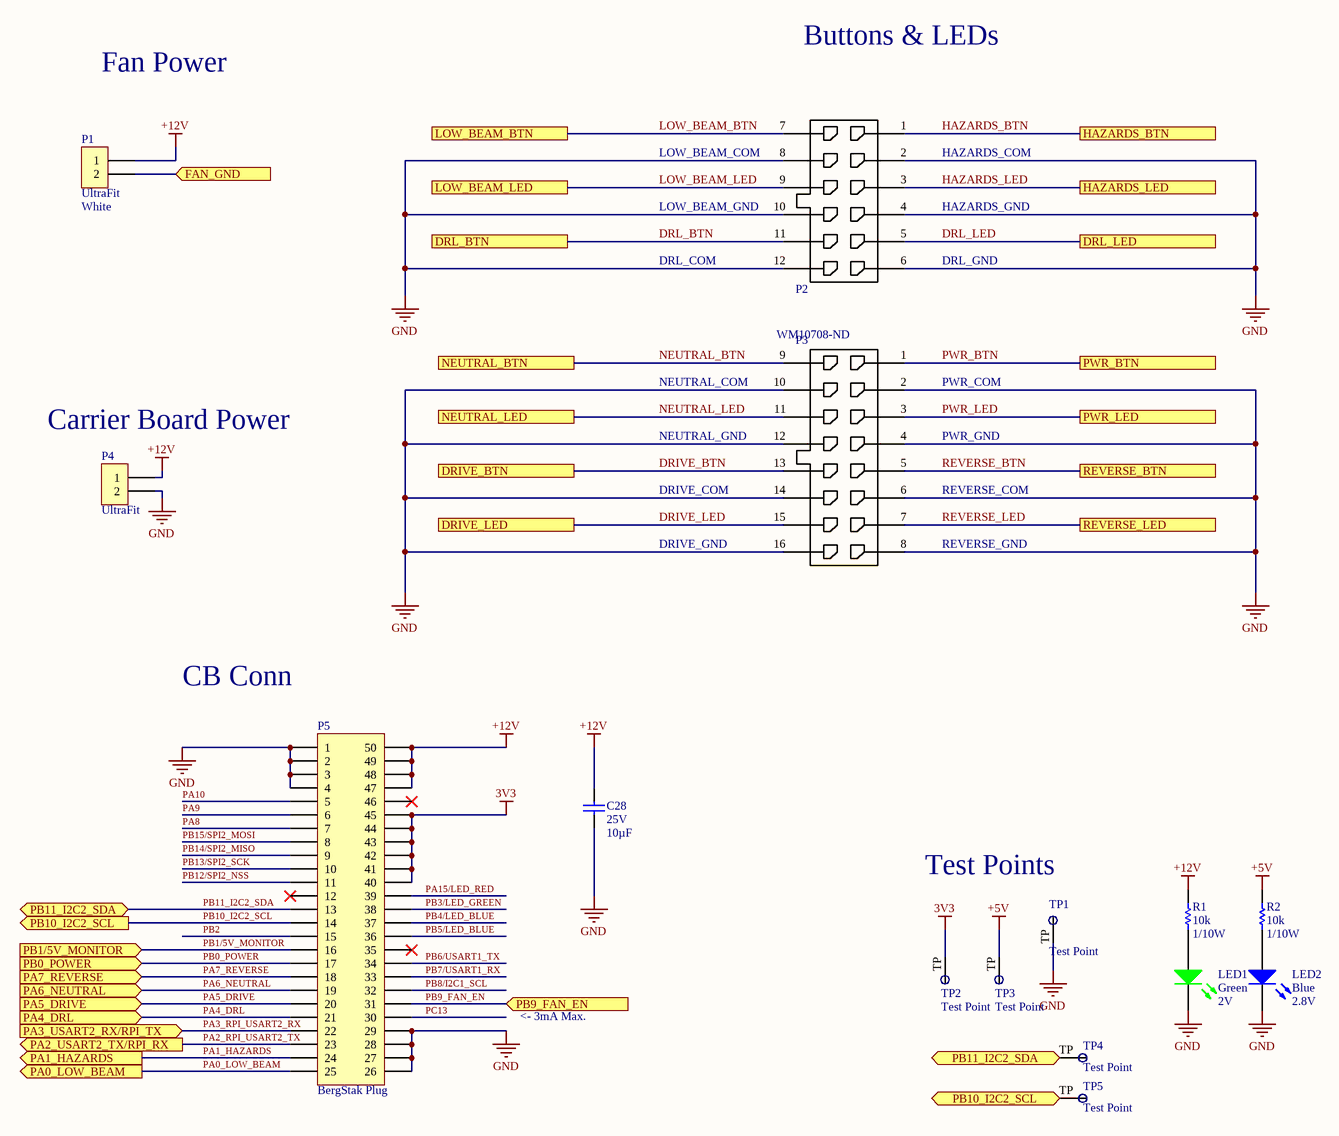
[diagram p2: connectors.SchDoc]

### Parts
C28  Voltage - Rated: 25V  Capacitance: 10µF  [CAP, 0805]  (hidden comment: CAP CER 10uF 25V 10% X5R 0805)
LED1  Color: Green  Voltage - Forward (Vf) (Typ): 2V  [LED_0603]  (hidden comment: LED GREEN CLEAR 2V 0603)
LED2  Color: Blue  Voltage - Forward (Vf) (Typ): 2.8V  [LED_0603]  (hidden comment: LED BLUE CLEAR 2.8V 0603)
P1  Series: UltraFit  Color: White  [CONN, 2POS ULTRA-FIT - NATURAL COLOR]  (hidden comment: CONN 2POS ULTRA-FIT NATURAL COLOR 0.138")
P2  CONN 12POS MICRO-FIT 3mm  [CONN, 12POS MICRO-FIT 3mm]  (value not drawn)
P3  Supplier Part Number 1: WM10708-ND  [CONN, 16POS MICRO-FIT 3MM]  (hidden comment: CONN 16POS MICRO-FIT 3mm)
P4  Series: UltraFit  [CONN, 2POS ULTRA-FIT]  (hidden comment: CONN 2POS ULTRA-FIT 0.138")
P5  Series: BergStak Plug  [CONN, Bergstak 50 Pos Plug]  (hidden comment: CONN 50POS Bergstak Plug 0.02")
R1  Resistance: 10k  Power: 1/10W  [RES, 0603]  (hidden comment: RES 10K OHM 1% 1/10W 0603)
R2  Resistance: 10k  Power: 1/10W  [RES, 0603]  (hidden comment: RES 10K OHM 1% 1/10W 0603)
TP1  Test Point  [Test Point]  (no BOM)
TP2  Test Point  [Test Point]  (no BOM)
TP3  Test Point  [Test Point]  (no BOM)
TP4  Test Point  [Test Point]  (no BOM)
TP5  Test Point  [Test Point]  (no BOM)

### Ports
DRIVE_BTN, DRIVE_LED, DRL_BTN, DRL_LED, FAN_GND (in), HAZARDS_BTN, HAZARDS_LED, LOW_BEAM_BTN, LOW_BEAM_LED, NEUTRAL_BTN, NEUTRAL_LED, PA0_LOW_BEAM (out), PA1_HAZARDS (out), PA2_USART2_TX/RPI_RX (out), PA3_USART2_RX/RPI_TX (in), PA4_DRL (in), PA5_DRIVE (in), PA6_NEUTRAL (in), PA7_REVERSE (in), PB0_POWER (in), PB1/5V_MONITOR (in), PB9_FAN_EN (in), PB10_I2C2_SCL (bidir), PB10_I2C2_SCL (out), PB11_I2C2_SDA (bidir), PWR_BTN, PWR_LED, REVERSE_BTN, REVERSE_LED

### Nets
3V3: P5.40 P5.41 P5.42 P5.43 P5.44 P5.45 TP2.TP
+5V: R2.1 TP3.TP
+12V: C28.1 P1.1 P4.1 P5.47 P5.48 P5.49 P5.50 R1.1
GND: C28.2 LED1.2(K) LED2.2(K) P2.2 P2.4 P2.6 P2.8 P2.10 P2.12 P3.2 P3.4 P3.6 P3.8 P3.10 P3.12 P3.14 P3.16 P4.2 P5.1 P5.2 P5.3 P5.4 P5.26 P5.27 P5.28 P5.29 TP1.TP
DRIVE_BTN: P3.13 ; port DRIVE_BTN
DRIVE_LED: P3.15 ; port DRIVE_LED
DRL_BTN: P2.11 ; port DRL_BTN
DRL_LED: P2.5 ; port DRL_LED
FAN_GND: P1.2 ; port FAN_GND
HAZARDS_BTN: P2.1 ; port HAZARDS_BTN
HAZARDS_LED: P2.3 ; port HAZARDS_LED
LOW_BEAM_BTN: P2.7 ; port LOW_BEAM_BTN
LOW_BEAM_LED: P2.9 ; port LOW_BEAM_LED
NEUTRAL_BTN: P3.9 ; port NEUTRAL_BTN
NEUTRAL_LED: P3.11 ; port NEUTRAL_LED
PA0_LOW_BEAM: P5.25 ; port PA0_LOW_BEAM
PA1_HAZARDS: P5.24 ; port PA1_HAZARDS
PA2_RPI_USART2_TX: P5.23 ; port PA2_USART2_TX/RPI_RX
PA3_RPI_USART2_RX: P5.22 ; port PA3_USART2_RX/RPI_TX
PA4_DRL: P5.21 ; port PA4_DRL
PA5_DRIVE: P5.20 ; port PA5_DRIVE
PA6_NEUTRAL: P5.19 ; port PA6_NEUTRAL
PA7_REVERSE: P5.18 ; port PA7_REVERSE
PA8: P5.7
PA9: P5.6
PA10: P5.5
PA15/LED_RED: P5.39
PB0_POWER: P5.17 ; port PB0_POWER
PB1/5V_MONITOR: P5.16 ; port PB1/5V_MONITOR
PB2: P5.15
PB3/LED_GREEN: P5.38
PB4/LED_BLUE: P5.37
PB5/LED_BLUE: P5.36
PB6/USART1_TX: P5.34
PB7/USART1_RX: P5.33
PB8/I2C1_SCL: P5.32
PB9_FAN_EN: P5.31 ; port PB9_FAN_EN
PB10_I2C2_SCL: P5.14 TP5.TP ; port PB10_I2C2_SCL
PB11_I2C2_SDA: P5.13 TP4.TP ; port PB11_I2C2_SDA
PB12/SPI2_NSS: P5.11
PB13/SPI2_SCK: P5.10
PB14/SPI2_MISO: P5.9
PB15/SPI2_MOSI: P5.8
PC13: P5.30
PWR_BTN: P3.1 ; port PWR_BTN
PWR_LED: P3.3 ; port PWR_LED
REVERSE_BTN: P3.5 ; port REVERSE_BTN
REVERSE_LED: P3.7 ; port REVERSE_LED
NetLED1_1: LED1.1(A) R1.2
NetLED2_1: LED2.1(A) R2.2

Not connected (* = marked no-connect by the designer): P5 12* 35* 46*

### Notes on the sheet
- Buttons & LEDs
- Fan Power
- LOW_BEAM_COM
- HAZARDS_COM
- LOW_BEAM_GND
- DRL_COM
- HAZARDS_GND
- DRL_GND
- NEUTRAL_COM
- PWR_COM
- (near P4) Carrier Board Power
- NEUTRAL_GND
- PWR_GND
- DRIVE_COM
- REVERSE_COM
- DRIVE_GND
- REVERSE_GND
- CB Conn
- (near TP1) Test Points
- <- 3mA Max.
- PROJECT
- DOCUMENT
- DRAWN BY
- LAST MODIFIED
- PART NUMBER
- REVISION
- SHEET
- VARIANT
- OF
- Engineering 5 - 1002
  University of Waterloo
  (519) 888-4567 x32978
  hardware@uwmidsun.com

### Library data of the parts
C28 = CAP CER 10uF 25V 10% X5R 0805: as C29 on sheet rPi; Supplier 1: Digi-Key; RoHS: RoHS Compliant; Category: Capacitors; Stock 1: 1695157; Packaging: Cut Tape (CT); Part Status: Active; Tolerance: ±10%; Temperature Coefficient: X5R; Operating Temperature: -55°C ~ 85°C; Features: -; Ratings: -; Applications: General Purpose; Mounting Type: Surface Mount, MLCC; Package / Case: 0805 (2012 Metric); Size / Dimension: 0.079" L x 0.049" W (2.00mm x 1.25mm); Height - Seated (Max): -; Thickness (Max): 0.053" (1.35mm); Lead Spacing: -; Lead Style: -; ComponentLink1URL: http://search.murata.co.jp/Ceramy/image/img/A01X/G101/ENG/GRM21BR61E106KA73-01.pdf; ComponentLink1Description: http://search.murata.co.jp/Ceramy/image/img/A01X/G101/ENG/GRM21BR61E106KA73-01.pdf; Supplier Part Number 1: 490-5523-1-ND; Pricing 1: 1=0.3, 10=0.214, 100=0.1008, 500=0.07068, 1000=0.05851 (CAD)
LED1 = LED GREEN CLEAR 2V 0603: Green 572nm LED Indication - Discrete 2V 0603 (1608 Metric); Manufacturer: Wurth Electronics Inc.; Manufacturer Part Number: 150060VS75000; Lens Color: Colorless; Millicandela Rating: 40mcd; Lens Style/Size: Rectangle with Flat Top, 1.10mm x 0.70mm; Current - Test: 20mA; Viewing Angle: 140°; Wavelength - Dominant: 570nm; Supplier 1: Digi-Key; RoHS: RoHS Compliant; Category: Optoelectronics; Stock 1: 9408; Pricing 1: 1=0.21, 100=0.1617, 500=0.13964 (CAD); Packaging: Cut Tape (CT); Part Status: Active; Lens Transparency: Clear; Mounting Type: Surface Mount; Wavelength - Peak: 572nm; Features: -; Package / Case: 0603 (1608 Metric); Supplier Device Package: 0603; Size / Dimension: 1.60mm L x 0.80mm W; Height (Max): 0.80mm; ComponentLink1URL: http://katalog.we-online.de/led/datasheet/150060VS75000.pdf; ComponentLink1Description: http://katalog.we-online.de/led/datasheet/150060VS75000.pdf; Supplier Part Number 1: 732-4980-1-ND
LED2 = LED BLUE CLEAR 2.8V 0603: Blue 470nm LED Indication - Discrete 2.8V 0603 (1608 Metric); Manufacturer 1: Lite-On Inc.; Manufacturer Part Number 1: LTST-C193TBKT-5A; Lens Color: Colorless; Millicandela Rating: 15mcd; Lens Style/Size: Rectangle with Flat Top, 1.15mm x 0.80mm; Current - Test: 5mA; Viewing Angle: 130°; Wavelength - Peak: 468nm; Supplier 1: Digi-Key; Supplier Part Number 1: 160-1827-1-ND; Packaging: Cut Tape (CT); Part Status: Active; Lens Transparency: Clear; Mounting Type: Surface Mount; Wavelength - Dominant: 470nm; Package / Case: 0603 (1608 Metric); Supplier Device Package: Chip LED; Size / Dimension: 1.60mm L x 0.80mm W; Height (Max): 0.45mm; ComponentLink1URL: http://optoelectronics.liteon.com/upload/download/DS22-2004-060/P_100_LTST-C193TBKT-5A.pdf; ComponentLink1Description: http://optoelectronics.liteon.com/upload/download/DS22-2004-060/P_100_LTST-C193TBKT-5A.pdf
P1 = CONN 2POS ULTRA-FIT NATURAL COLOR 0.138": 2 Positions Header, Shrouded Connector 0.138" (3.50mm) Through Hole; Manufacturer 1: Molex, LLC; Manufacturer Part Number 1: 1722872102; Style: Board to Cable/Wire; Shrouding: Shrouded - 4 Wall; Number of Positions: 2; Number of Positions Loaded: All; Contact Length - Post: 0.126" (3.20mm); Material Flammability Rating: UL94 V-0; Mated Stacking Heights: 26.99mm; Voltage: 400V; Supplier 1: Digi-Key; Supplier Part Number 1: WM11722-ND; Packaging: Tray; Part Status: Active; Connector Type: Header; Contact Type: Male Pin; Pitch - Mating: 0.138" (3.50mm); Number of Rows: 1; Row Spacing - Mating: -; Mounting Type: Through Hole; Termination: Solder; Fastening Type: Latch Holder; Contact Length - Mating: -; Overall Contact Length: -; Insulation Height: 0.465" (11.80mm); Contact Shape: Square; Contact Finish - Mating: Tin; Contact Finish Thickness - Mating: 60µin (1.52µm); Contact Finish - Post: Tin; Contact Material: Copper Alloy; Insulation Material: Liquid Crystal Polymer (LCP); Operating Temperature: -40°C ~ 105°C; Ingress Protection: -; Insulation Color: Natural; Current Rating: -; Contact Finish Thickness - Post: 60µin (1.52µm); ComponentLink1URL: http://www.molex.com/pdm_docs/sd/1722872102_sd.pdf; ComponentLink1Description: http://www.molex.com/pdm_docs/sd/1722872102_sd.pdf
P2 = CONN 12POS MICRO-FIT 3mm: Connector Header Through Hole 12 position 0.118" (3.00mm); Manufacturer: Molex, LLC; Manufacturer Part Number: 0430451227; Number of Positions: 12; Number of Positions Loaded: All; Style: Board to Cable/Wire; Shrouding: Shrouded - 4 Wall; Contact Length - Post: 0.125" (3.18mm); Material Flammability Rating: UL94 V-0; Supplier 1: Digi-Key; RoHS: RoHS Compliant; Category: Connectors, Interconnects; Stock 1: 1709; Pricing 1: 1=3.61, 10=3.283, 25=3.0816, 50=2.9478, 100=2.8138, 250=2.5458, 500=2.34482, 1008=2.00985, 3024=1.87586 (CAD); Packaging: Tray; Part Status: Active; Connector Type: Header; Contact Type: Male Pin; Pitch - Mating: 0.118" (3.00mm); Number of Rows: 2; Row Spacing - Mating: 0.118" (3.00mm); Mounting Type: Through Hole; Termination: Solder; Fastening Type: Locking Ramp; Contact Length - Mating: -; Overall Contact Length: -; Insulation Height: 0.390" (9.91mm); Contact Shape: Square; Contact Finish - Mating: Tin; Contact Finish Thickness - Mating: 60.0µin (1.52µm); Contact Finish - Post: Tin; Contact Material: Brass; Insulation Material: Liquid Crystal Polymer (LCP), Glass Filled; Features: Board Guide; Operating Temperature: -; Ingress Protection: -; Insulation Color: Black; Current Rating: -; Voltage Rating: -; Mated Stacking Heights: -; Contact Finish Thickness - Post: -; Applications: General Purpose, Medical, Military, Telecommunications; ComponentLink1URL: https://www.molex.com/pdm_docs/sd/430451227_sd.pdf; ComponentLink1Description: https://www.molex.com/pdm_docs/sd/430451227_sd.pdf; Supplier Part Number 1: WM10697-ND
P3 = CONN 16POS MICRO-FIT 3mm: Connector Header Through Hole 16 position 0.118"(3.00mm); Manufacturer: Molex; Manufacturer Part Number: 0430451627; Contact Resistance: 10mR; Number of Positions: 16; Number of Ports: 1; Connector Type: Male Pin; Row Spacing: 0.118inch; Supplier 1: Digi-Key; RoHS: Yes; Stock 1: 4654; Pricing 1: 1 = 3.26000, 10 = 3.12900, 25 = 2.86800, 50 = 2.73780, 100 = 2.60740, 250 = 2.28148, 792 = 2.02073, 1584 = 1.82518, 3168 = 1.75999 (USD); Mount: Through Hole; Color: Black; Contact Material: Brass; Contact Plating: Tin; Number of Terminals: 16; Housing Color: Black; Housing Material: Polymer; Min Operating Temperature: -40°C; Max Operating Temperature: 105°C; Package Quantity: 792; Number of Rows: 2; Fastening Type: Ramp; Packaging: Tray; Termination: Solder; Number of Contacts: 16; Orientation: Straight; Length: 28.15mm; Pitch: 3mm; Depth: 8.77mm; ComponentLink1URL: http://www.molex.com/pdm_docs/sd/430451627_sd.pdf; ComponentLink1Description: http://www.molex.com/pdm_docs/sd/430451627_sd.pdf; ComponentLink2URL: http://www.molex.com/webdocs/datasheets/pdf/en-us/0430451627_PCB_HEADERS.pdf; ComponentLink2Description: http://www.molex.com/webdocs/datasheets/pdf/en-us/0430451627_PCB_HEADERS.pdf
P4 = CONN 2POS ULTRA-FIT 0.138": 2 Positions Header, Shrouded Connector 0.138" (3.50mm) Through Hole Gold; Manufacturer 1: Molex, LLC; Manufacturer Part Number 1: 1722861302; Style: Board to Board or Cable; Shrouding: Shrouded - 4 Wall; Number of Positions: 2; Number of Positions Loaded: All; Contact Length - Post: 0.126" (3.20mm); Material Flammability Rating: UL94 V-0; Mated Stacking Heights: 26.99mm; Voltage: 400V; Supplier 1: Digi-Key; Supplier Part Number 1: WM11673-ND; Packaging: Tray; Part Status: Active; Connector Type: Header; Contact Type: Male Pin; Pitch - Mating: 0.138" (3.50mm); Number of Rows: 1; Row Spacing - Mating: -; Mounting Type: Through Hole; Termination: Kinked Pin, Solder; Fastening Type: Latch Holder; Contact Length - Mating: -; Overall Contact Length: -; Insulation Height: 0.465" (11.80mm); Contact Shape: Square; Contact Finish - Mating: Gold; Contact Finish Thickness - Mating: 30µin (0.76µm); Contact Finish - Post: Tin; Contact Material: Copper Alloy; Insulation Material: Liquid Crystal Polymer (LCP); Operating Temperature: -40°C ~ 120°C; Ingress Protection: -; Insulation Color: Black; Current Rating: -; Contact Finish Thickness - Post: 60µin (1.52µm); ComponentLink1URL: http://www.molex.com/pdm_docs/sd/1722861302_sd.pdf; ComponentLink1Description: http://www.molex.com/pdm_docs/sd/1722861302_sd.pdf
P5 = CONN 50POS Bergstak Plug 0.02": 50 Position Connector Plug, Outer Shroud Contacts Surface Mount Gold; Manufacturer 1: Amphenol FCI; Manufacturer Part Number 1: 10132797-055100LF; Number of Positions: 50; Mated Stacking Heights: 5mm; Pitch: 0.020" (0.50mm); Supplier 1: Digi-Key; Supplier Part Number 1: 609-5226-1-ND; Packaging: Cut Tape (CT); Part Status: Active; Connector Type: Plug, Outer Shroud Contacts; Number of Rows: 2; Mounting Type: Surface Mount; Contact Finish: Gold; Contact Finish Thickness: 1µin (0.025µm); Height Above Board: 0.169" (4.30mm); ComponentLink1URL: http://portal.fciconnect.com/Comergent//fci/drawing/10132797.pdf; ComponentLink1Description: http://portal.fciconnect.com/Comergent//fci/drawing/10132797.pdf
R1 R2 = RES 10K OHM 1% 1/10W 0603: as R28 on sheet rPi; Supplier 1: Digi-Key; Supplier Part Number 1: 311-10.0KHRCT-ND; Packaging: Cut Tape (CT); Part Status: Active; Composition: Thick Film; Operating Temperature: -55°C ~ 155°C; Package / Case: 0603 (1608 Metric); Supplier Device Package: 0603; Size / Dimension: 0.063" L x 0.031" W (1.60mm x 0.80mm); Height - Seated (Max): 0.022" (0.55mm); Failure Rate: -; ComponentLink1URL: http://www.yageo.com/documents/recent/PYu-RC_Group_51_RoHS_L_7.pdf; ComponentLink1Description: http://www.yageo.com/documents/recent/PYu-RC_Group_51_RoHS_L_7.pdf; Tolerance: ±1%